# Altium schematic sheet Voltage Regulation.SchDoc
size A4
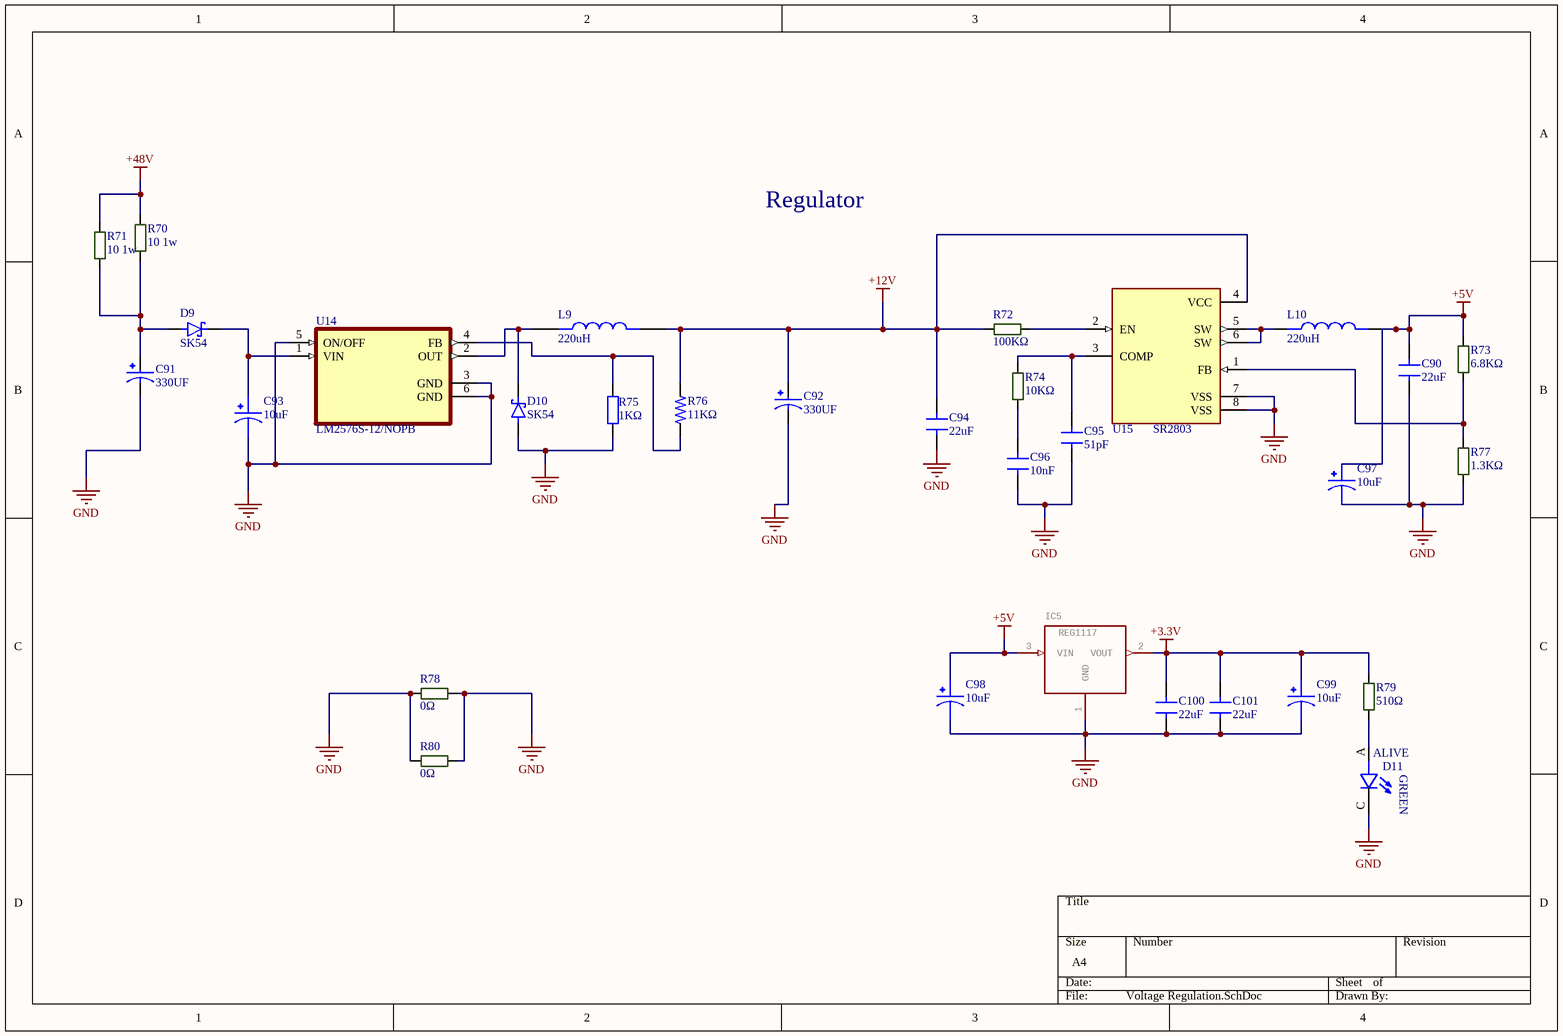
[diagram p0: Voltage Regulation.SchDoc]

## Parts
C90  22uF  [C-0805]
C91  330UF  [CAP_EEETC1C331V]
C92  330UF  [CAP_EEETC1C331V]
C93  10uF  [CapSmdElc]
C94  22uF  [C-0805]
C95  51pF  [C-0603W]
C96  10nF  [C-0805]
C97  10uF  [CapSmdElc]
C98  10uF  [CapSmdElc]
C99  10uF  [CapSmdElc]
C100  22uF  [C-0805]
C101  22uF  [C-0805]
D9  SK54  [DIOM7959X265N]
D10  SK54  [DIOM7959X265N]
D11  ALIVE  [LED_7012X1]
IC5  REG1117  [SOT223]
L9  220uH  [IND_MDH12577C-101MA=P3]
L10  220uH  [IND_MDH12577C-101MA=P3]
R70  10 1w  [R-2512]
R71  10 1w  [R-2512]
R72  100KΩ  [R-0805]
R73  6.8KΩ  [R-0603R]
R74  10KΩ  [R-0805]
R75  Deger: 1KΩ  [R-0805]  (hidden comment: RES SMD 1K OHM 1% 1/8W 0805)
R76  11KΩ  [R-0805]
R77  1.3KΩ  [R-0603R]
R78  0Ω  [R-2512]
R79  510Ω  [R-0603R]
R80  0Ω  [R-2512]
U14  LM2576S-12/NOPB  [VREG_TPS79625KTTR]
U15  SR2803  [SOP127P600X175-8N]

## Nets
+3.3V: C99.1 C100.2 C101.2 IC5.2(VOUT) R79.2
+5V: C90.2 C97.1 C98.1 IC5.3(VIN) L10.2 R73.2
+12V: C92.1 C94.2 L9.2 R72.2 R76.2 U15.4(VCC)
+48V: R70.2 R71.2
GND: C90.1 C91.2 C92.2 C93.2 C94.1 C95.1 C96.1 C97.2 C98.2 C99.2 C100.1 C101.1 D10.A D11.C IC5.1(GND) R75.1 R77.1 R78.1 R78.2 R80.1 R80.2 U14.3(GND) U14.5(ON/OFF) U14.6(GND) U15.7(VSS) U15.8(VSS)
NetC91_1: C91.1 D9.A R70.1 R71.1
NetC93_1: C93.1 D9.C(K) U14.1(VIN)
NetC95_2: C95.2 R74.2 U15.3(COMP)
NetC96_2: C96.2 R74.1
NetD10_C: D10.C(K) L9.1 U14.2(OUT)
NetD11_A: D11.A R79.1
NetL10_1: L10.1 U15.5(SW) U15.6(SW)
NetR72_1: R72.1 U15.2(EN)
NetR73_1: R73.1 R77.2 U15.1(FB)
NetR75_2: R75.2 R76.1 U14.4(FB)

## Notes on the sheet
- Regulator
- (in symbol ALIVE) GREEN

## Library data of the parts
C90 C94 C96 C100 C101 = C-0805
C91 C92 = CAP 330UF SMD: CAP ALUM 330UF 20% 16V SMD; MP: EEE-TC1C331V; MF: Panasonic Electronic Components; Value: *; Package: RADIAL-2 Panasonic; Availability: In Stock; SnapEDA_Link: https://www.snapeda.com/parts/EEE-TC1C331V/Panasonic/view-part/6178283/?ref=snap; Price: None; Purchase-URL: https://pricing.snapeda.com/search/part/EEE-TC1C331V/?ref=eda; Check_prices: https://www.snapeda.com/parts/EEE-TC1C331V/Panasonic/view-part/6178283/?ref=eda
C93 C97-C99 = 100 uF Electr Cap
C95 = C-0603
D9 D10 = SK54: Diode Schottky 40V 5A Surface Mount DO-214AA (SMB); MP: MBRS320T3G; MF: ON Semiconductor; Package: DO-214 ON Semiconductor; Availability: Good; Arrow_Electronics-Purchase-URL: https://snapeda.com/shop?store=Arrow+Electronics&id=432205; SnapEDA_Link: https://www.snapeda.com/parts/MBRS320T3G/ON%20Semiconductor/view-part/432205/?ref=snap; DigiKey-Purchase-URL: https://snapeda.com/shop?store=DigiKey&id=432205; Mouser-Purchase-URL: https://snapeda.com/shop?store=Mouser&id=432205; Value: *; Price: None
D11 = ALIVE: Green LED Indication - Discrete 1.7V 0805 (2012 Metric); MP: 7012X1; Package: None; Price: None; Value: *; Availability: Unavailable
IC5 = REG1117: 800mA and 1A Low Dropout (LDO) Positive Regulator   1.8V, 2.5V, 2.85V, 3.3V, 5V, and Adj; GateName_1: G$1; SymbolName_1: REG1118; LibraryName: burr-brown; DeviceSetName: REG1117; MF: MF; MPN: REG1117; OC_FARNELL: 1097566; OC_NEWARK: 14P6981
L9 L10 = 220uH Inductor SMD: Inductor Power Shielded Wirewound 220uH 20% 100KHz Ferrite 1.1A 0.325Ohm DCR 5049 Automotive T/R; MP: MDH12577C-101MA=P3; Package: None; Price: None; Value: *; Availability: Unavailable
R70 R71 = R-2512
R72 R74 = R-0805
R73 R77 R79 = R-0603
R75 = 1K 0805: 1 kOhms ±1% 0.125W, 1/8W Chip Resistor 0805 (2012 Metric) Moisture Resistant Thick Film; Cins: Direnc; Uretici Kodu: RC0805FR-071KL; Kılıf: 0805; -Sicaklik: -55; +Sicaklik: +155; Lehim Yöntemi: SMD; MSL: 1 (Unlimited)
R76 = RES 11KΩ SMD: THICK FILM RESISTOR, 11KOHM, 125mW, 5%; MP: CRCW080511K0JNEA; Package: None; Price: None; Value: *; Availability: Unavailable
R78 R80 = R-2512: 10 1w
U14 = LM2576S-12/NOPB: SIMPLE SWITCHER&reg; 40V, 3A Low Component Count Step-Down Regulator 5-DDPAK/TO-263 -40 to 125; MF: Texas Instruments; Availability: Warning; SnapEDA_Link: https://www.snapeda.com/parts/LM2576S-12/NOPB/Texas%20Instruments/view-part/470772/?ref=snap; Mouser-Purchase-URL: https://snapeda.com/shop?store=Mouser&id=470772; Texas_Instruments-Purchase-URL: https://snapeda.com/shop?store=Texas+Instruments&id=470772; Value: *; Price: None; Package: TO-263-5 Texas Instruments; DigiKey-Purchase-URL: https://snapeda.com/shop?store=DigiKey&id=470772; MP: LM2576S-12/NOPB; BuyPart: https://www.snapeda.com/parts/LM2576S-12/NOPB/Texas%20Instruments/view-part/470772/?ref=eda
U15 = SR2803: 330KHZ, 3A SYNCHRONOUS / BUCK CONTROLLER; MF: Taiwan Semiconductor Corporation; MP: TS2509CS RLG; Package: SOP-8 Taiwan Semiconductor; Check_prices: https://www.snapeda.com/parts/TS2509CS%20RLG/Taiwan+Semiconductor+Corporation/view-part/?ref=eda; Value: *; Price: None; Availability: In Stock; SnapEDA_Link: https://www.snapeda.com/parts/TS2509CS%20RLG/Taiwan+Semiconductor+Corporation/view-part/?ref=snap